# EAGLE design Rear MCN Breakout (EAGLE 5.12)
PARTNO: RC0603JR-1010KL

## Sheet 1 of 2
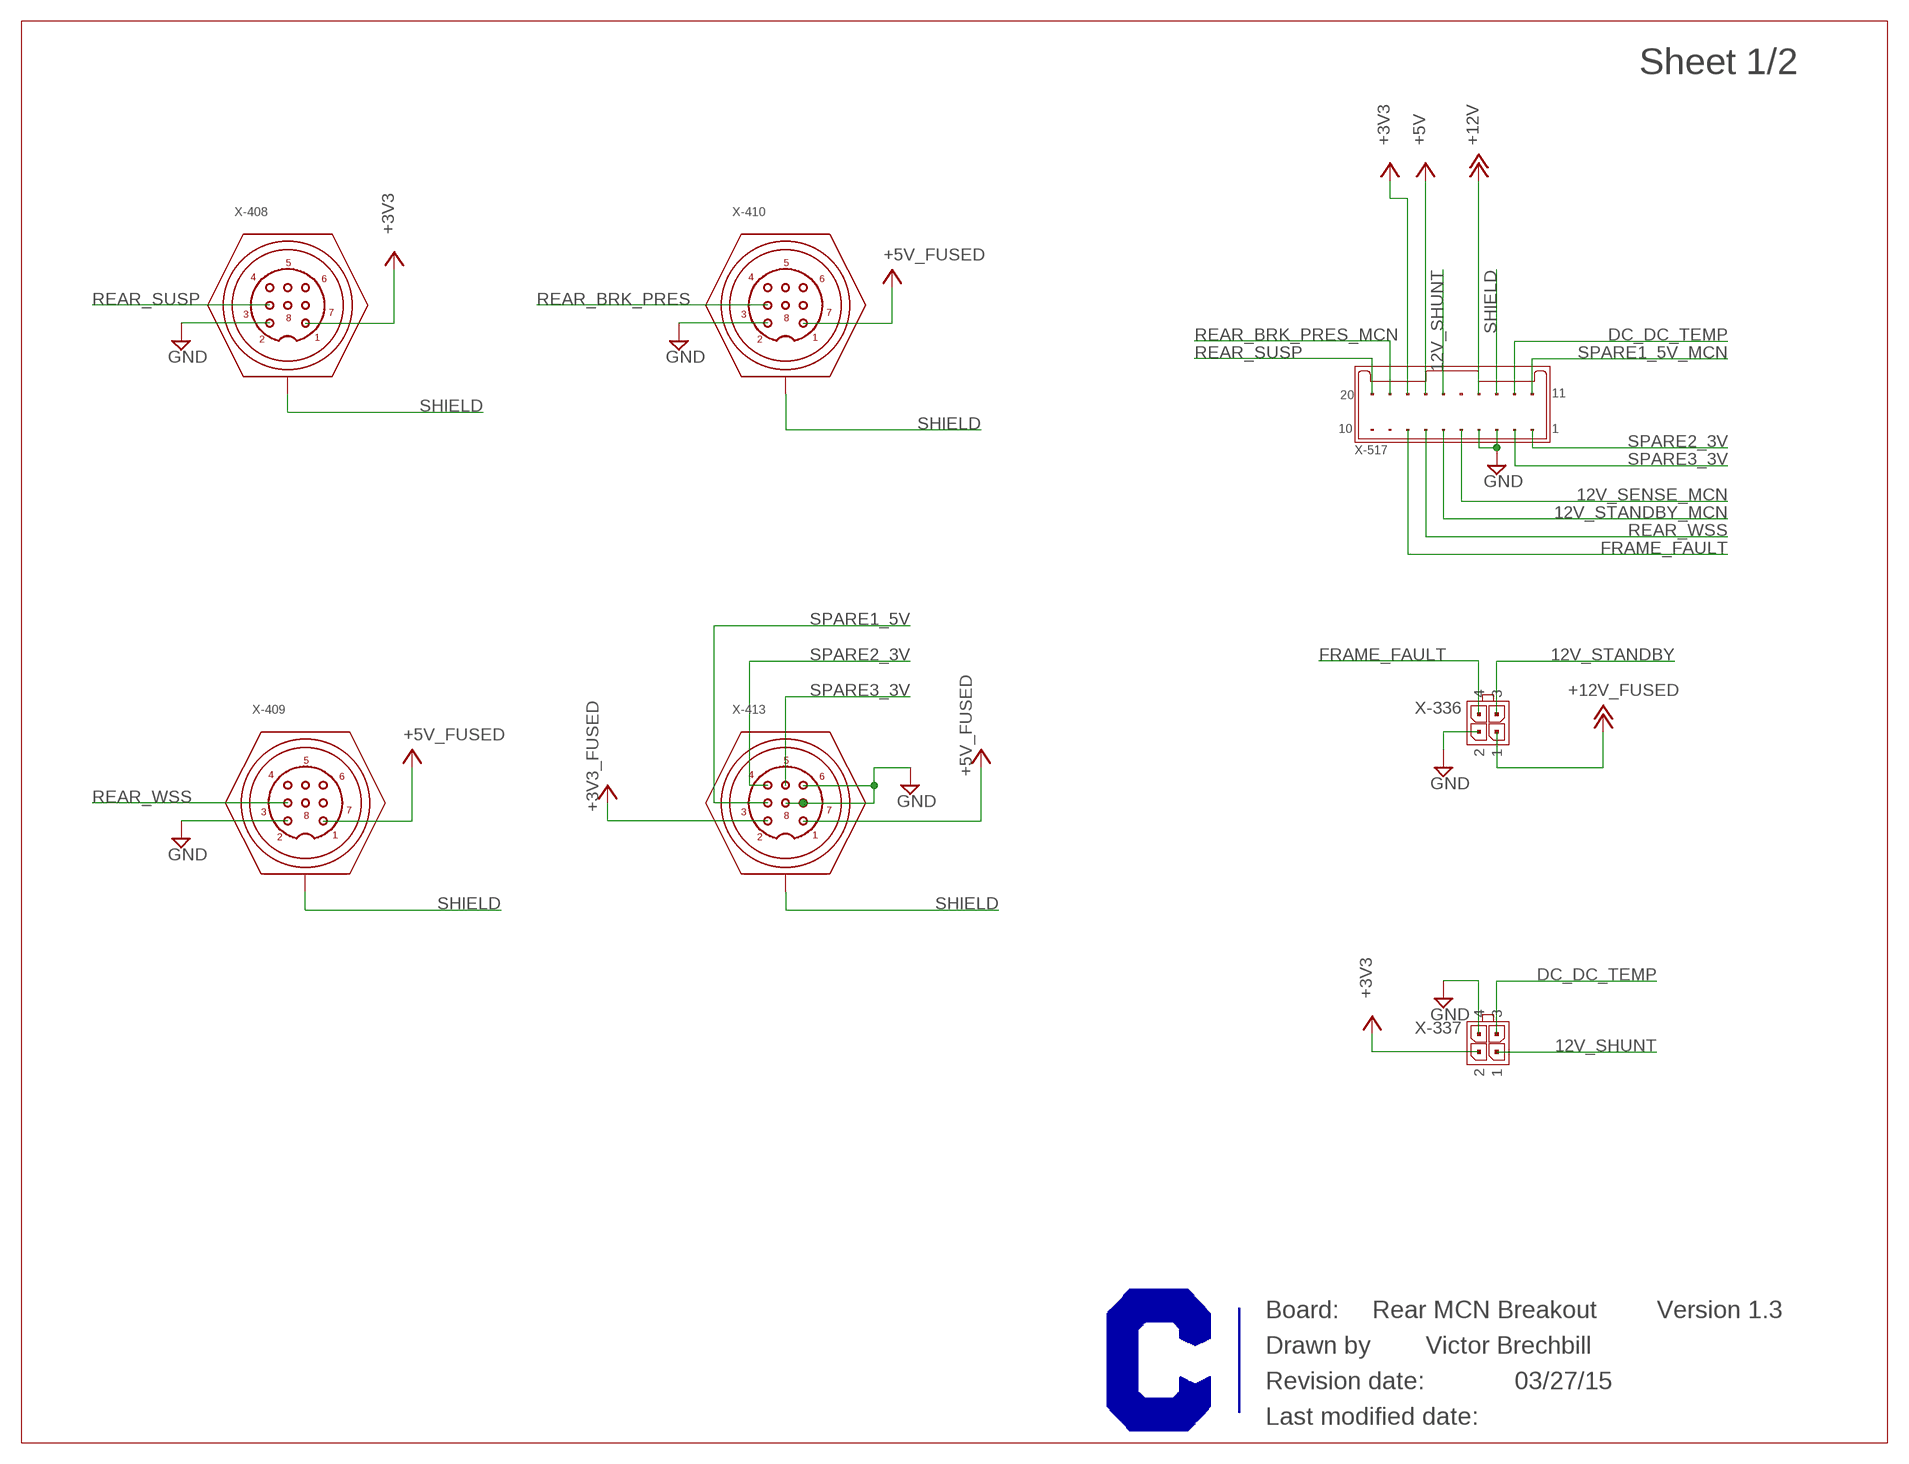
[diagram p0: schematic, sheet 1]

### Parts
U$1  CURRENT-C-LETTER-LANDSCAPE  [BLANK]
X-336  MICROFIT-04-DUAL-VERT-SMD  [MICROFIT-4-DUAL-VERT-SMD]
X-337  MICROFIT-04-DUAL-VERT-SMD  [MICROFIT-4-DUAL-VERT-SMD]
X-408  M8-8  [M8-VERT-8POS]
X-409  M8-8  [M8-VERT-8POS]
X-410  M8-8  [M8-VERT-8POS]
X-413  M8-8  [M8-VERT-8POS]
X-517  MICROCLASP-20-DUAL-RA  [MICROCLASP-20-DUAL-RA]

### Nets
12V_SENSE_MCN: X-517.5 ; also sheet 2
12V_SHUNT: X-337.1 X-517.16
12V_STANDBY: X-336.3 ; also sheet 2
12V_STANDBY_MCN: X-517.6 ; also sheet 2
+3V3: X-337.2 X-408.P$1 X-517.18 ; also sheet 2
+3V3_FUSED: X-413.P$2 ; also sheet 2
+5V: X-517.17 ; also sheet 2
+5V_FUSED: X-409.P$1 X-410.P$1 X-413.P$1 ; also sheet 2
+12V: X-517.14 ; also sheet 2
+12V_FUSED: X-336.1 ; also sheet 2
DC_DC_TEMP: X-337.3 X-517.12 ; also sheet 2
FRAME_FAULT: X-336.4 X-517.8 ; also sheet 2
GND: X-336.2 X-337.4 X-408.P$2 X-409.P$2 X-410.P$2 X-413.P$6 X-413.P$7 X-413.P$8 X-517.3 X-517.4 ; also sheet 2
REAR_BRK_PRES: X-410.P$3 ; also sheet 2
REAR_BRK_PRES_MCN: X-517.19 ; also sheet 2
REAR_SUSP: X-408.P$3 X-517.20
REAR_WSS: X-409.P$3 X-517.7 ; also sheet 2
SHIELD: X-408.SHLD(SHIELD) X-409.SHLD(SHIELD) X-410.SHLD(SHIELD) X-413.SHLD(SHIELD) X-517.13
SPARE1_5V: X-413.P$3 ; also sheet 2
SPARE1_5V_MCN: X-517.11 ; also sheet 2
SPARE2_3V: X-413.P$4 X-517.1
SPARE3_3V: X-413.P$5 X-517.2
Unconnected: X-408.P$4 X-408.P$5 X-408.P$6 X-408.P$7 X-408.P$8 X-409.P$4 X-409.P$5 X-409.P$6 X-409.P$7 X-409.P$8 X-410.P$4 X-410.P$5 X-410.P$6 X-410.P$7 X-410.P$8 X-517.9 X-517.10 X-517.15

### Notes on the sheet
- Rear MCN Breakout | Version 1.3
- Victor Brechbill
- 03/27/15

## Sheet 2 of 2
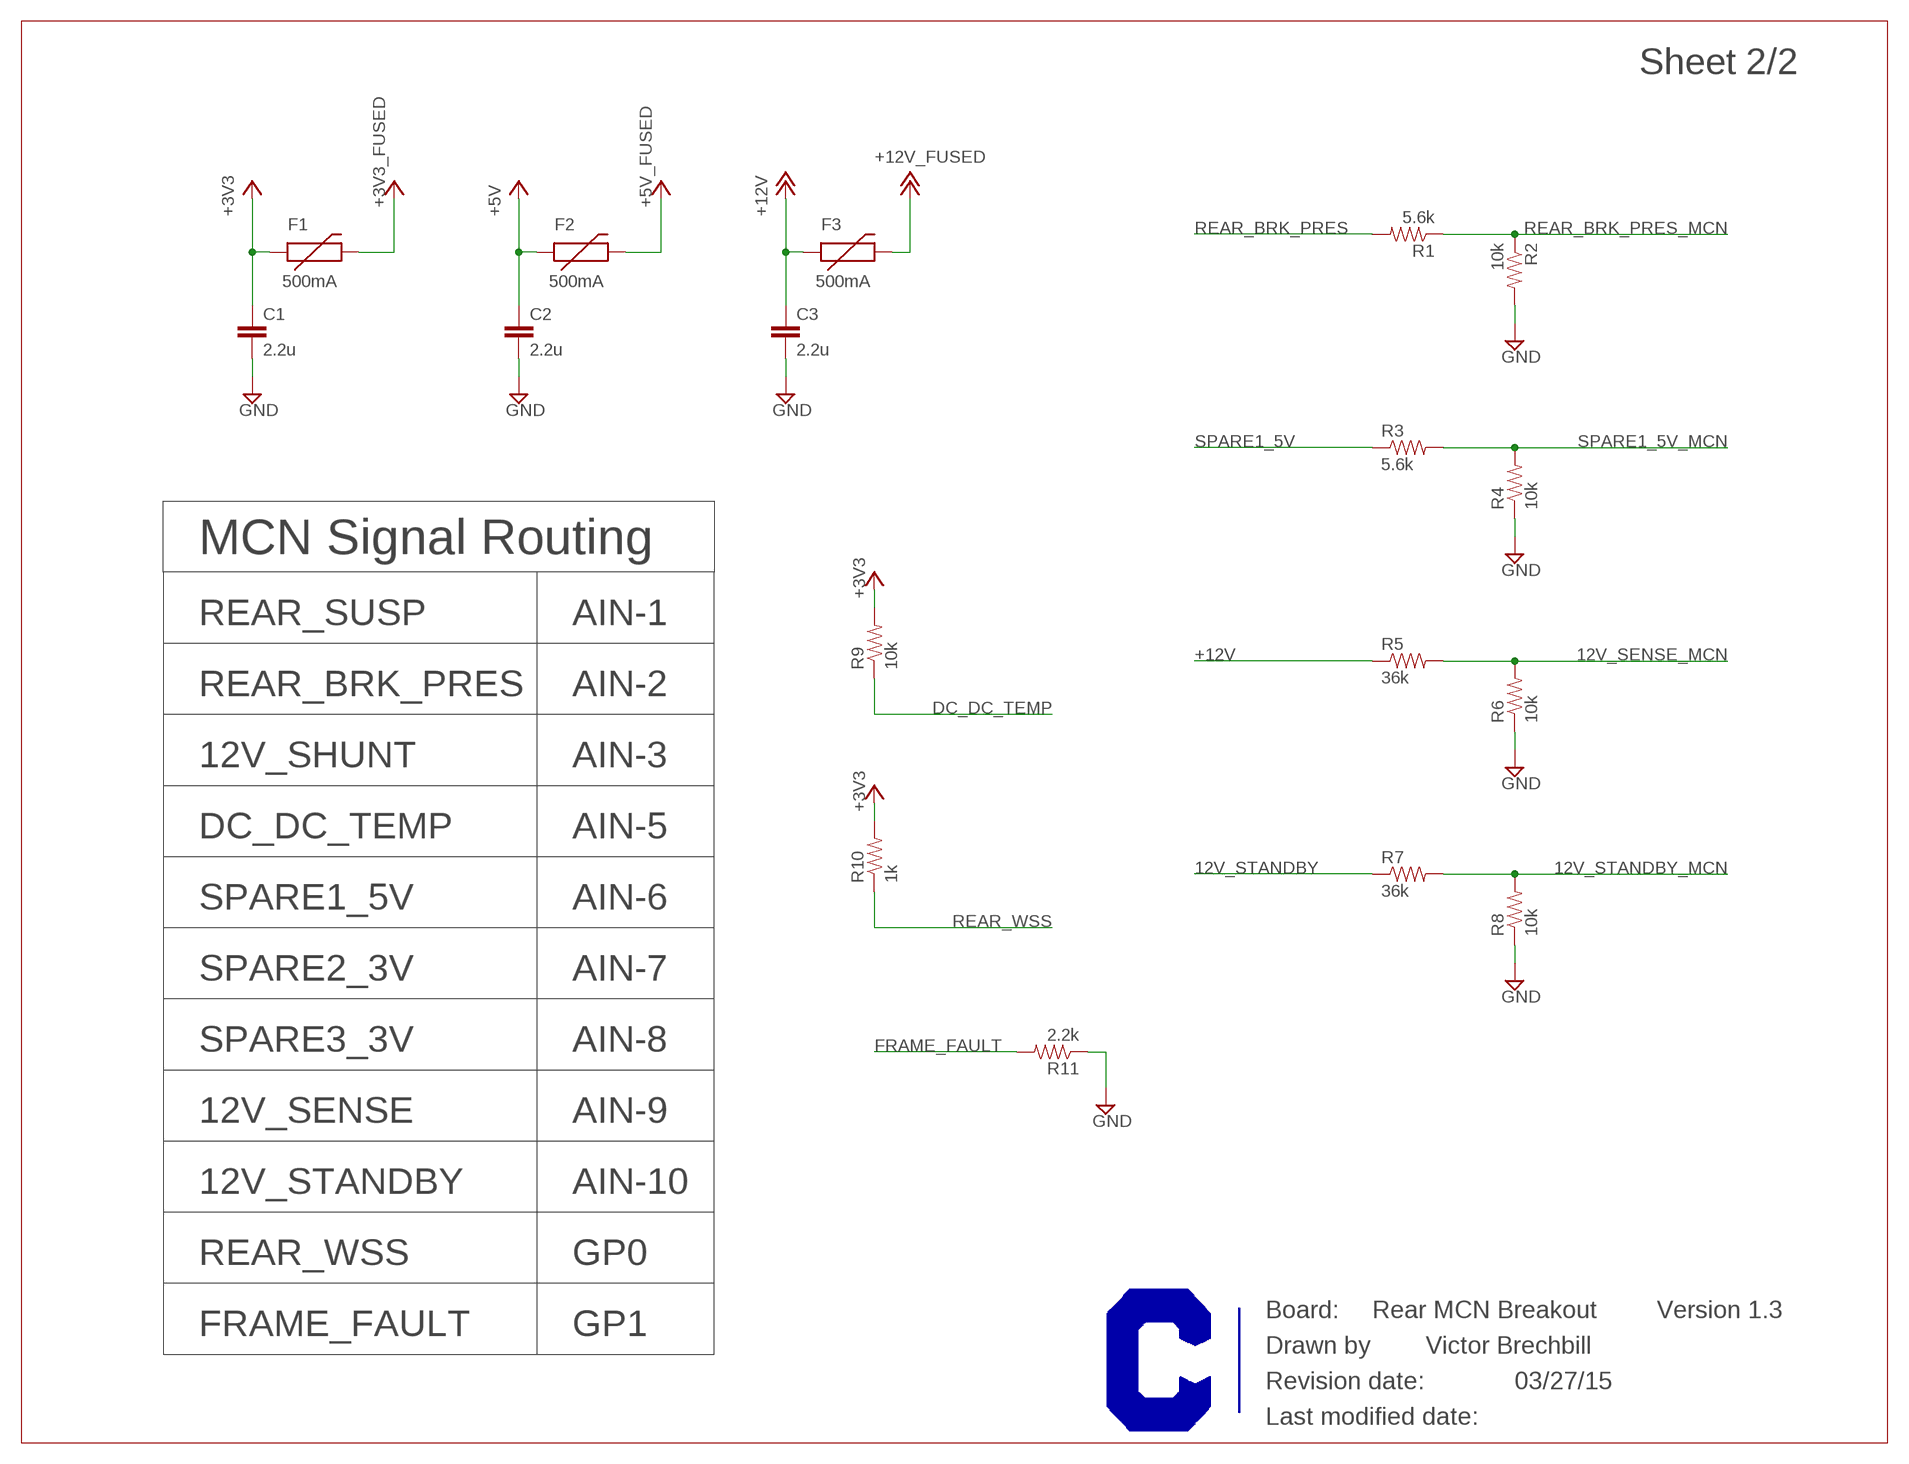
[diagram p1: schematic, sheet 2]

### Parts
C1  2.2u  CAP0603-CAP  [0603-CAP]
C2  2.2u  CAP0603-CAP  [0603-CAP]
C3  2.2u  CAP0603-CAP  [0603-CAP]
F1  500mA  PTC0603  [0603]
F2  500mA  PTC0603  [0603]
F3  500mA  PTC0603  [0603]
R1  5.6k  RESISTOR0603-RES  [0603-RES]
R2  10k  RESISTOR0603-RES  [0603-RES]
R3  5.6k  RESISTOR0603-RES  [0603-RES]
R4  10k  RESISTOR0603-RES  [0603-RES]
R5  36k  RESISTOR0603-RES  [0603-RES]
R6  10k  RESISTOR0603-RES  [0603-RES]
R7  36k  RESISTOR0603-RES  [0603-RES]
R8  10k  RESISTOR0603-RES  [0603-RES]
R9  10k  RESISTOR0603-RES  [0603-RES]
R10  1k  RESISTOR0603-RES  [0603-RES]
R11  2.2k  RESISTOR0603-RES  [0603-RES]
U$2  CURRENT-C-LETTER-LANDSCAPE  [BLANK]

### Nets
12V_SENSE_MCN: R5.2 R6.2 ; also sheet 1
12V_STANDBY: R7.1 ; also sheet 1
12V_STANDBY_MCN: R7.2 R8.2 ; also sheet 1
+3V3: C1.1 F1.1 R9.2 R10.2 ; also sheet 1
+3V3_FUSED: F1.2 ; also sheet 1
+5V: C2.1 F2.1 ; also sheet 1
+5V_FUSED: F2.2 ; also sheet 1
+12V: C3.1 F3.1 R5.1 ; also sheet 1
+12V_FUSED: F3.2 ; also sheet 1
DC_DC_TEMP: R9.1 ; also sheet 1
FRAME_FAULT: R11.2 ; also sheet 1
GND: C1.2 C2.2 C3.2 R2.2 R4.1 R6.1 R8.1 R11.1 ; also sheet 1
REAR_BRK_PRES: R1.2 ; also sheet 1
REAR_BRK_PRES_MCN: R1.1 R2.1 ; also sheet 1
REAR_WSS: R10.1 ; also sheet 1
SPARE1_5V: R3.1 ; also sheet 1
SPARE1_5V_MCN: R3.2 R4.2 ; also sheet 1

### Notes on the sheet
- MCN Signal Routing
- REAR_SUSP | AIN-1
- REAR_BRK_PRES | AIN-2
- 12V_SHUNT | AIN-3
- DC_DC_TEMP | AIN-5
- SPARE1_5V | AIN-6
- SPARE2_3V | AIN-7
- SPARE3_3V | AIN-8
- 12V_SENSE | AIN-9
- 12V_STANDBY | AIN-10
- REAR_WSS | GP0
- Rear MCN Breakout | Version 1.3
- FRAME_FAULT | GP1
- Victor Brechbill
- 03/27/15

## Library data of the parts
C1-C3 = SparkFun:CAP: Capacitor Standard 0603 ceramic capacitor, and 0.1" leaded capacitor.
F1-F3 = SparkFun:PTC: Resettable Fuse PTC Resettable Fuse. Spark Fun Electronics SKU : COM-08357
R1-R11 = SparkFun:RESISTOR: Resistor Basic schematic elements and footprints for 0603, 1206, and PTH resistors.
U$1 U$2 = Frames:CURRENT-C-LETTER-LANDSCAPE; BOM: EXCLUDE
X-336 X-337 = Molex:MICROFIT-04-DUAL: Molex MicroFit 3.00mm Pitch Header, Surface Mount, Dual Row, 4 Circuits Molex P/N: 43045-0609 (vert) Drawing: http://www.molex.com/pdm_docs/sd/430450418_sd.pdf (vert) Information: http://www.molex.com/molex/products/datasheet.jsp?part=active/0430450418_PCB_HEADERS.xml (vert)
X-408-X-410 X-413 = Conec:M8-8
X-517 = Molex:MICROCLASP-20-DUAL

## Board
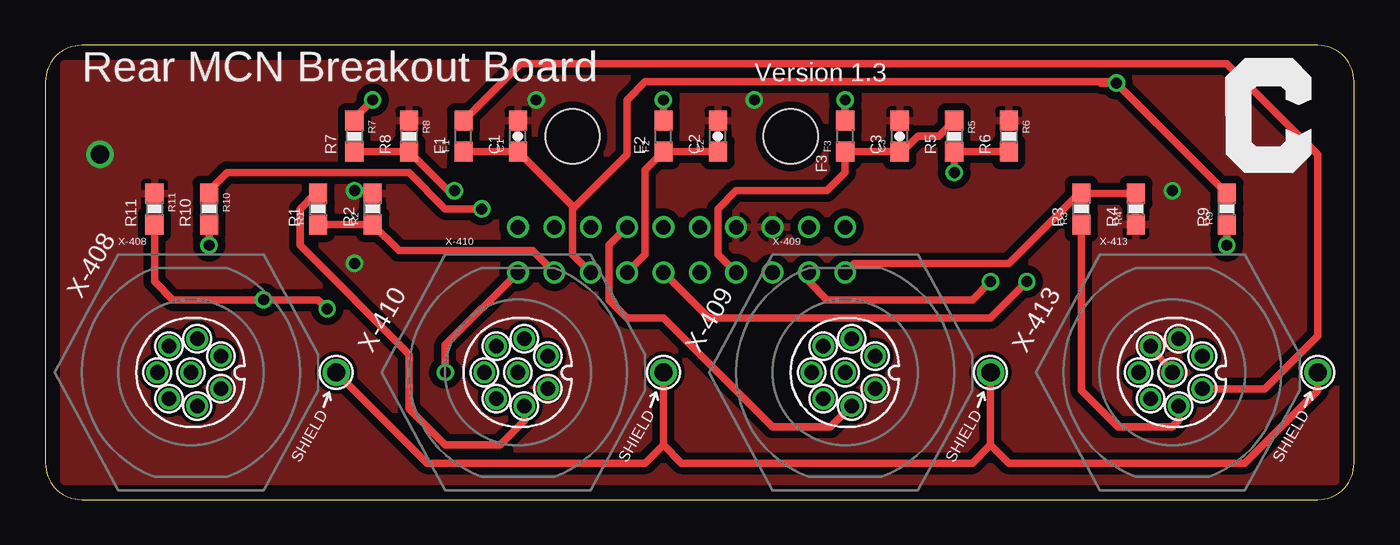
[diagram p2: board, top side]
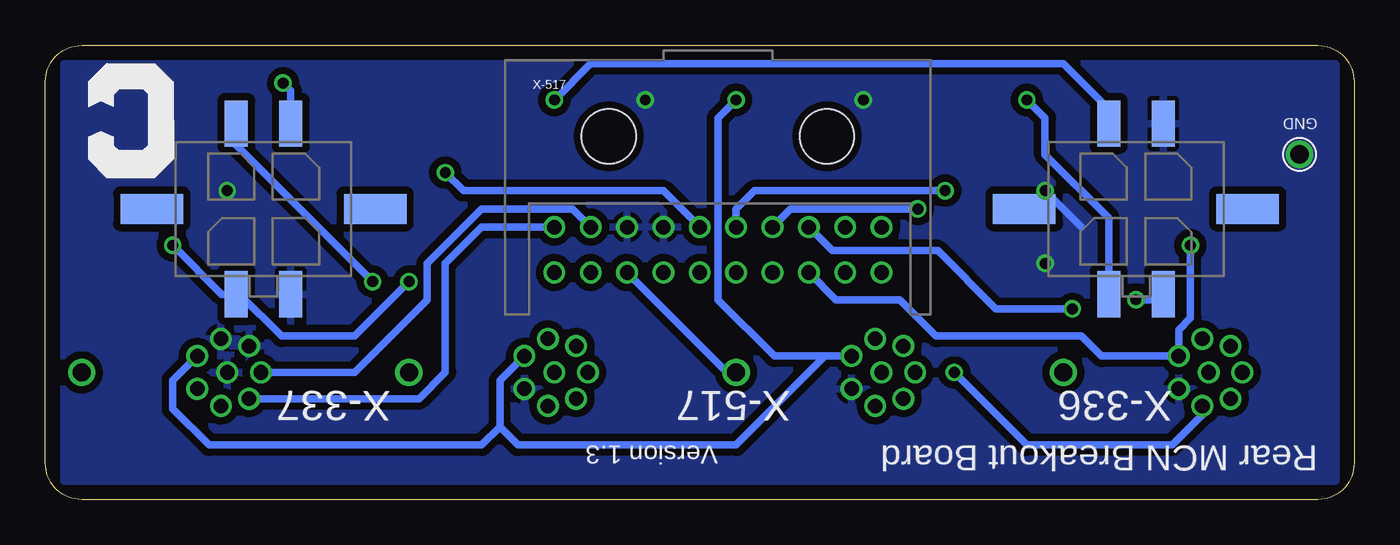
[diagram p3: board, bottom side, seen from below]

Size 72 x 25 mm. Coordinates in mm from the lower left corner, seen from the top.
Outline: 72,23 arc90 70,25 2,25 arc90 0,23 0,2 arc90 2,0 70,0 arc90 72,2 72,23
Copper layers (1*16): Top 0.0356mm / dielectric 1.5011mm / Bottom 0.0356mm
Design rules "OSH Park 2-layer": minimum track width 6mil, minimum drill 13mil, track to track 6mil, track to pad 6mil, pad to pad 6mil, via to via 6mil, smd to smd 6mil, copper to edge 15mil, drill to drill 6mil, minimum pad ring 7mil, minimum via ring 7mil, stop-mask expansion 4mil, vias tented up to drill 25mil, thermal gap 10mil
Holes 3 mm at 29,20 41,20

### Footprints (pad centres in the part's own frame; a part is rotated, then mirrored left to right if it is on the bottom)
0603-CAP = smd 1.1 x 1: 1 -0.85,0; 2 0.85,0
0603 = smd 1.1 x 1: 1 -0.85,0; 2 0.85,0
0603-RES = smd 1.1 x 1: 1 -0.85,0; 2 0.85,0
MICROFIT-4-DUAL-VERT-SMD = smd 1.27 x 2.54: 1 1.5,-4.699; 2 -1.5,-4.699; 3 1.5,4.699; 4 -1.5,4.699 | smd 3.43 x 1.65: 5 6.147,0; 6 -6.147,0
M8-VERT-8POS = drill 0.8 round: P$1 1.65,0.9; P$2 1.65,-0.9; P$3 0.35,-1.85; P$4 -1.2,-1.45; P$5 -1.85,0; P$6 -1.2,1.45; P$7 0.35,1.85; P$8 0,0 | drill 1 round: SHLD 8,0
MICROCLASP-20-DUAL-RA = drill 0.8 round: 1 -9,0; 2 -7,0; 3 -5,0; 4 -3,0; 5 -1,0; 6 1,0; 7 3,0; 8 5,0; 9 7,0; 10 9,0; 11 -9,-2.5; 12 -7,-2.5; 13 -5,-2.5; 14 -3,-2.5; 15 -1,-2.5; 16 1,-2.5; 17 3,-2.5; 18 5,-2.5; 19 7,-2.5; 20 9,-2.5

### Placement (x,y rotation side)
C1  26,20 90 top
C2  37,20 90 top
C3  47,20 90 top
F1  23,20 90 top
F2  34,20 90 top
F3  44,20 90 top
R1  15,16 90 top
R2  18,16 90 top
R3  57,16 90 top
R4  60,16 90 top
R5  50,20 270 top
R6  53,20 270 top
R7  17,20 270 top
R8  20,20 270 top
R9  65,16 90 top
R10  9,16 270 top
R11  6,16 270 top
U$1  -49.53,63.5 0 top  (outside the outline)
U$2  -52.07,63.5 0 top  (outside the outline)
X-336  12,16 180 bottom
X-337  60,16 180 bottom
X-408  8,7 0 top
X-409  44,7 0 top
X-410  26,7 0 top
X-413  62,7 0 top
X-517  35,15 0 bottom

### Tracks (layer width: path | path; a pad name or v marks a point on that pad's centre or on a via)
12V_SENSE_MCN  (via drill 0.6)
  Top 0.406: R6.2 R5.2 v50,18
  Bottom 0.406: X-517.5 38,17 49,17 v50,18
12V_SHUNT  (via drill 0.6)
  Top 0.406: X-517.16 36.5,10 52,10 v54,12
  Bottom 0.406: v54,12 61.5,19.5 X-337.1
12V_STANDBY  (via drill 0.6)
  Top 0.406: v18,22 17,21 R7.1
  Bottom 0.406: X-336.3 13.5,15.5 17,19 17,21 v18,22
12V_STANDBY_MCN  (via drill 0.6)
  Top 0.406: R7.2 R8.2 21.07,18.07 21.15,18 22.15,17 v22.5,17
  Bottom 0.406: X-517.6 34,16 33,17 v22.5,17
+3V3  (via drill 0.6)
  Top 0.406: X-517.18 29,13.5 29,16 | 29,16 29,16.15 C1.1 F1.1 | v9,14 R10.2 | v58.92,22.93 58.85,23 58,23 | v58.92,22.93 R9.2 | 58,23 33,23 32,22 32,19 29,16 | v58.92,22.93 58.08,22.93 58,23
  Bottom 0.406: X-517.18 28.5,11 25,11 23,9 15,9 13.9,7.9 X-408.P$1 9.65,9.35 9,10 v9,14 | X-337.2 58.5,22.5 v58.92,22.93
+3V3_FUSED
  Top 0.406: X-413.P$2 67.1,6.1 70,9 70,19 65,24 26.15,24 F1.2
+5V
  Top 0.406: C2.1 F2.1 33,18.15 33,13.5 X-517.17
+5V_FUSED  (via drill 0.6)
  Top 0.406: v34,22 F2.2
  Bottom 0.406: 27.9,7.9 X-410.P$1 29.1,7.9 | X-409.P$1 47,6.55 47,4 | 47,4 46,3 34,3 29.1,7.9 | X-413.P$1 65,6.55 65,5 63,3 48,3 47,4 | 29.1,7.9 31.9,7.9 35,11 35,21 v34,22
+12V
  Top 0.406: X-517.14 37,13.5 37,16 38,17 43,17 44,18 F3.1 C3.1 47.15,19.15 48,20 49.15,20 R5.1
+12V_FUSED  (via drill 0.6)
  Top 0.406: v44,22 F3.2
  Bottom 0.406: v44,22 42,24 16,24 13.5,21.5 X-336.1
DC_DC_TEMP  (via drill 0.6)
  Top 0.406: v65,14 R9.1 | X-517.12 42,12 43,11 51,11 v52,12
  Bottom 0.406: v52,12 55,9 59,9 61.3,11.3 X-337.3 62.3,11.3 v65,14
FRAME_FAULT  (via drill 0.6)
  Top 0.406: R11.2 6,12 7,11 11,11 v12,11 15,11 v15.5,10.5
  Bottom 0.406: v15.5,10.5 19.7,10.5 22.9,13.7 28.7,13.7 X-517.8 | X-336.4 10.8,11 v12,11
GND  (via drill 0.6, 1)
  Top 0.406: X-413.P$6 X-413.P$8 | R2.2 17.85,17 v17,17
  Bottom 0.406: 15,15 v17,17
  other vias: 3,19 17,13 27,22 39,22 62,17
  pour Bottom (isolate 0.406): 1,24 1,1 71,1 71,24
  pour Top (isolate 0.406): 1,24 1,1 71,1 71,24
REAR_BRK_PRES
  Top 0.406: X-410.P$3 26.35,4.35 25,3 22,3 20,5 20,8 14,14 14,16 14.85,16.85 R1.2
REAR_BRK_PRES_MCN
  Top 0.406: R1.1 R2.1 19.45,13.7 26.8,13.7 X-517.19
REAR_SUSP  (via drill 0.6)
  Top 0.406: v22,7 22,8.5 X-517.20
  Bottom 0.406: X-408.P$3 8.35,4.65 10,3 18,3 v22,7
REAR_WSS  (via drill 0.6)
  Top 0.406: R10.1 9,17 10,18 20,18 22,16 v24,16 | X-517.7 31,14 31,11 32,10 34,10 40,4 43.2,4 X-409.P$3
  Bottom 0.406: v24,16 31,16 X-517.7
SHIELD
  Top 0.406: X-408.SHLD 21,2 33,2 34,3 | 34,3 35,2 51,2 52,3 | 52,3 53,2 66,2 70,6 X-413.SHLD | 52,3 X-409.SHLD | 34,3 X-410.SHLD
  Bottom 0.406: X-517.13 34.5,7 X-410.SHLD
SPARE1_5V
  Top 0.406: R3.1 57,6 59,4 62,4 62.35,4.35 X-413.P$3
SPARE1_5V_MCN
  Top 0.406: R4.2 R3.2 56.85,16.85 53,13 44.5,13 X-517.11
SPARE2_3V
  Bottom 0.406: X-517.1 48,15 50,13 50,7 51.45,5.55 X-413.P$4
SPARE3_3V
  Bottom 0.406: X-517.2 43,16 48,16 51,13 51,11 55,7 X-413.P$5

### Text on the board
_tsilk: Rear MCN Breakout Board | Version 1.3 | R7 | R8 | F1 | C1 | F2 | C2 | C3 | R5 | R6 | F3 | R11 | R10 | R1 | R2 | R3 | R4 | R9 | X-408 | X-410 | X-409 | X-413
_bsilk: GND | X-336 | X-517 | X-337 | Rear MCN Breakout Board | Version 1.3